# Altium schematic sheet Periphery.SchDoc
size A4; SheetNumber: 7; SheetTotal: 7
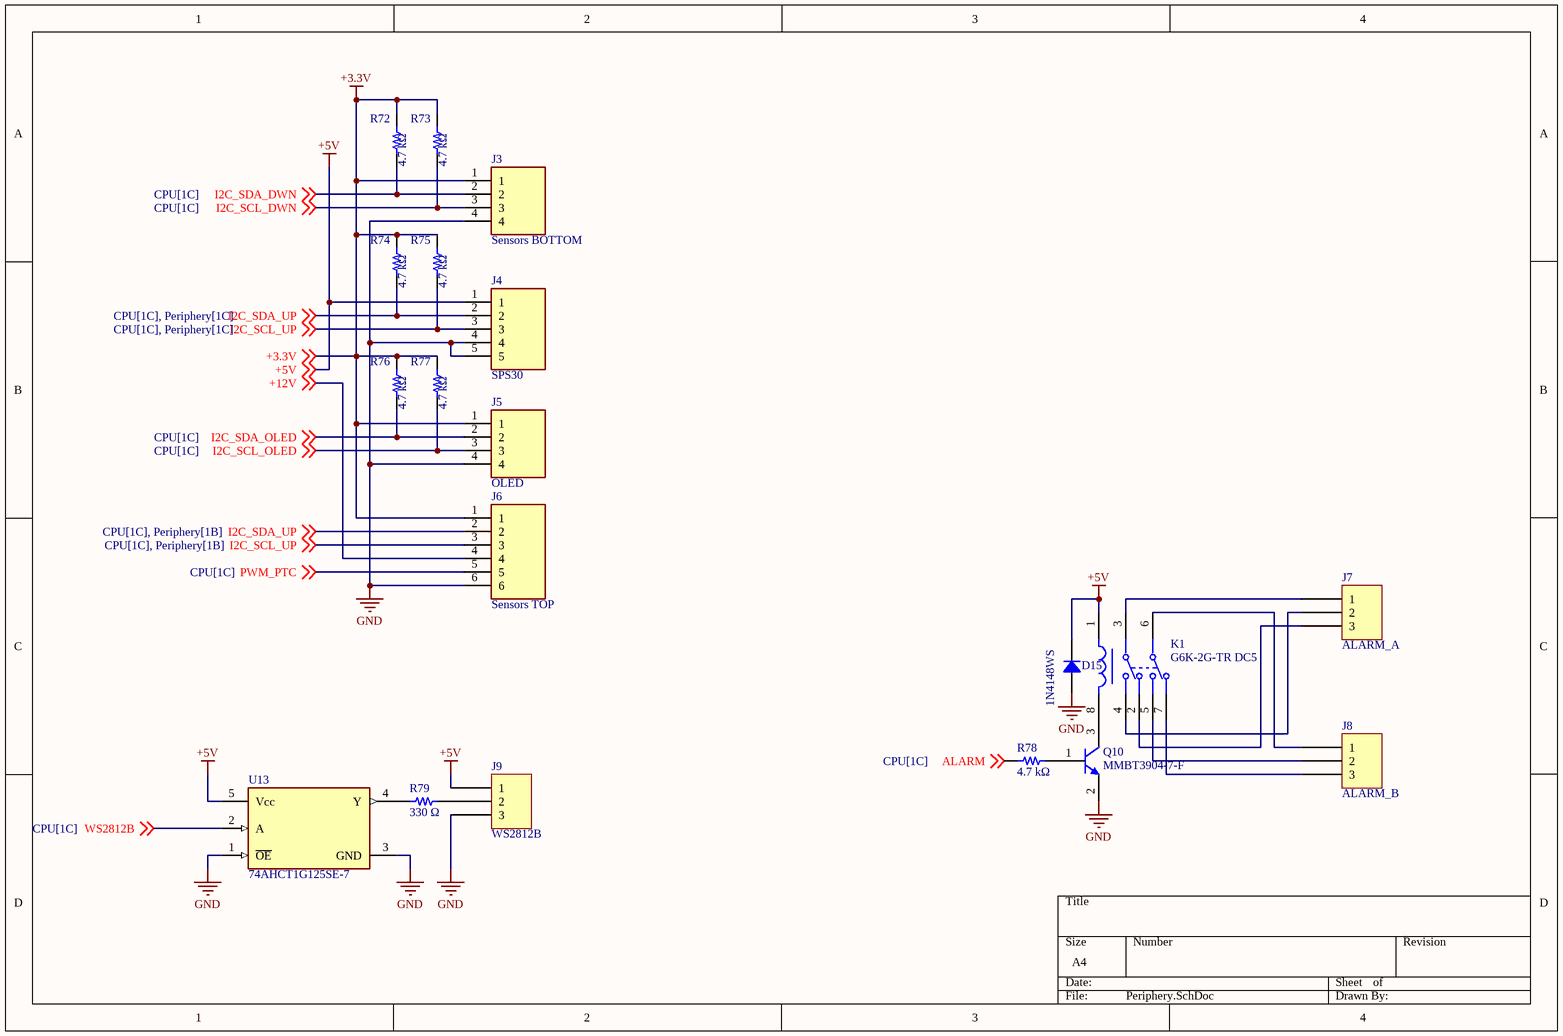
[diagram p0: Periphery.SchDoc]

## Parts
D15  1N4148WS  [SOD323F]
J3  Sensors BOTTOM  [SHDR4W50P0X150_1X4_750X350X450P]
J4  SPS30  [SHDR5W50P0X150_1X5_900X350X450P]
J5  OLED  [SHDR4W50P0X150_1X4_750X350X450P]
J6  Sensors TOP  [SHDR6W50P0X150_1X6_1050X350X450P]
J7  ALARM_A  [MOLEX KK 0022272031]
J8  ALARM_B  [MOLEX KK 0022272031]
J9  WS2812B  [MOLEX KK 0022272031]
K1  G6K-2G-TR DC5  [FP-G6K-2G-TR_DC5-MFG]
Q10  MMBT3904-7-F  [DIODES SOT-23-3]
R72  4.7 kΩ  [RES 0603_1608]
R73  4.7 kΩ  [RES 0603_1608]
R74  4.7 kΩ  [RES 0603_1608]
R75  4.7 kΩ  [RES 0603_1608]
R76  4.7 kΩ  [RES 0603_1608]
R77  4.7 kΩ  [RES 0603_1608]
R78  4.7 kΩ  [RES 0603_1608]
R79  330 Ω  [RES 0603_1608]
U13  74AHCT1G125SE-7  [FP-SOT353-IPC_A]

## Nets
+3.3V: J3.1 J5.1 J6.1 R72.2 R73.2 R74.2 R75.2 R76.2 R77.2 ; off-sheet +3.3V
+5V: D15.2 J4.1 J9.1 K1.1 U13.5(Vcc) ; off-sheet +5V
GND: D15.1 J3.4 J4.4 J4.5 J5.4 J6.6 J9.3 Q10.2(E) U13.1(~{OE}) U13.3(GND)
+12V: J6.4 ; off-sheet +12V
ALARM: R78.1 ; off-sheet ALARM
I2C_SCL_DWN: J3.3 R73.1 ; off-sheet I2C_SCL_DWN
I2C_SCL_OLED: J5.3 R77.1 ; off-sheet I2C_SCL_OLED
I2C_SCL_UP: J4.3 J6.3 R75.1 ; off-sheet I2C_SCL_UP
I2C_SDA_DWN: J3.2 R72.1 ; off-sheet I2C_SDA_DWN
I2C_SDA_OLED: J5.2 R76.1 ; off-sheet I2C_SDA_OLED
I2C_SDA_UP: J4.2 J6.2 R74.1 ; off-sheet I2C_SDA_UP
PWM_PTC: J6.5 ; off-sheet PWM_PTC
WS2812B: U13.2(A) ; off-sheet WS2812B
NetJ7_1: J7.1 K1.3
NetJ7_2: J7.2 K1.4
NetJ7_3: J7.3 K1.2
NetJ8_1: J8.1 K1.6
NetJ8_2: J8.2 K1.5
NetJ8_3: J8.3 K1.7
NetJ9_2: J9.2 R79.2
NetK1_8: K1.8 Q10.3(C)
NetQ10_1: Q10.1(B) R78.2
NetR79_1: R79.1 U13.4(Y)

## Library data of the parts
D15 = 1N4148WS: DIODE GEN PURP 75V 150MA SOD323F; Manufacturer: ON Semiconductor; Current - Reverse Leakage @ Vr: 5µA @ 75V; Diode Type: Standard; Reverse Recovery Time (trr): 4ns; Speed: Small Signal =< 200mA (Io), Any Speed; Voltage - Forward (Vf) (Max) @ If: 1V @ 10mA; Part Number: 1N4148WS; ComponentLink1Description: Datasheet; ComponentLink1URL: https://www.onsemi.com/pub/Collateral/1N914BWS-D.pdf; ComponentLink2Description: DigiKey Link; ComponentLink2URL: http://digikey.com/product-detail/en/on-semiconductor/1N4148WS/1N4148WSFSCT-ND/1873821; Current - Average Rectified (Io): 150mA; LastUpdated: 3.06.2024 19:55:04; Lifecycle Status: Active; Minimum Order: 1; Mounting Type: Surface Mount; Operating Temperature - Junction: 150°C (Max); Package / Case: SC-90, SOD-323F; Packaging: TapeAndReel; PartId: 1158; Part Status: Active; Price: 0.03; Series: -; Supplier 1: DigiKey; Supplier Part Number 1: 1N4148WSFSCT-ND; Supplier Device Package: SOD-323F; Voltage - DC Reverse (Vr) (Max): 75V
J3 J5 = B4B-ZR: JST (JAPAN SOLDERLESS TERMINALS) - B4B-ZR(LF)(SN) - HEADER, TOP ENTRY, 4WAY; Geometry.Height: 4.5mm; Manufacturer_Name: JST (JAPAN SOLDERLESS TERMINALS); Manufacturer_Part_Number: B4B-ZR(LF)(SN); Mouser Part Number: 306-B4B-ZRLFSN; Mouser Price/Stock: https://www.mouser.co.uk/ProductDetail/JST-Commercial/B4B-ZRLFSN?qs=QpmGXVUTftFM%252B0QwnoJl9g%3D%3D; Arrow Part Number: B4B-ZR(LF)(SN); Arrow Price/Stock: https://www.arrow.com/en/products/b4b-zr-lf-sn/jst-manufacturing?region=europe; Datasheet Link: https://datasheet.datasheetarchive.com/originals/distributors/Datasheets_SAMA/cb62f9f85e77727a538b6695add69f99.pdf; Supplier 1: DigiKey; Supplier Part Number 1: 455-1659-ND
J4 = B5B-ZR: CONN HEADER VERT 5POS 1.5MM; Manufacturer_Name: JST (JAPAN SOLDERLESS TERMINALS); Manufacturer_Part_Number: B5B-ZR(LF)(SN); Geometry.Height: 4.5mm; Mouser Part Number: N/A; Mouser Price/Stock: https://www.mouser.co.uk/ProductDetail/JST-Commercial/B5B-ZRLFSN?qs=IKkN%2F947nfC1UhZj5V253g%3D%3D; Arrow Part Number: B5B-ZR(LF)(SN); Arrow Price/Stock: https://www.arrow.com/en/products/b5b-zr-lf-sn/jst-manufacturing?region=europe; Datasheet Link: https://datasheet.lcsc.com/szlcsc/JST-Sales-America-B5B-ZR-LF-SN_C157990.pdf; Supplier 1: DigiKey; Supplier Part Number 1: 455-1660-ND
J6 = B6B-ZR: CONN HEADER ZH TOP 6POS 1.5MM; Manufacturer_Name: JST (JAPAN SOLDERLESS TERMINALS); Geometry.Height: 4.5mm; Manufacturer_Part_Number: B6B-ZR; Mouser Part Number: N/A; Mouser Price/Stock: https://www.mouser.co.uk/ProductDetail/JST/B6B-ZR?qs=BJlw7L4Cy7%2FnnkhPIMLEpQ%3D%3D; Arrow Part Number: *; Arrow Price/Stock: *; Datasheet Link: http://www.jst-mfg.com/product/pdf/eng/eZH.pdf; Supplier 1: DigiKey; Supplier Part Number 1: 455-B6B-ZR-ND
J7-J9 = 0022272031: CONN HEADER VERT 3POS 2.54MM; Manufacturer: Molex; Contact Length - Mating: 0.295" (7.49mm); Contact Length - Post: 0.140" (3.56mm); Material Flammability Rating: UL94 V-0; Number of Positions: 3; Number of Positions Loaded: All; Overall Contact Length: 0.560" (14.22mm); Pitch - Mating: 0.100" (2.54mm); Shrouding: Shrouded - 1 Wall; Style: Board to Cable/Wire; Part Number: 0022272031; ComponentLink1Description: Datasheet; ComponentLink1URL: https://www.molex.com/pdm_docs/sd/022272031_sd.pdf; ComponentLink2Description: DigiKey Link; ComponentLink2URL: http://digikey.com/product-detail/en/molex/0022272031/WM4112-ND/1130578; Connector Type: Header; Contact Finish - Mating: Tin; Contact Finish - Post: Tin; Contact Finish Thickness - Mating: 100.0µin (2.54µm); Contact Material: Brass; Contact Shape: Square; Contact Type: Male Pin; Fastening Type: Friction Lock; Insulation Color: Natural; Insulation Height: 0.461" (11.70mm); Insulation Material: Polyamide (PA), Nylon; LastUpdated: 12.01.2020 23:51:54; Lifecycle Status: Active; Minimum Order: 1; Mounting Type: Through Hole; Number of Rows: 1; Packaging: Bulk; PartId: 77; Part Status: Active; Price: 0.37; Series: KK 6410; Supplier 1: DigiKey; Supplier Part Number 1: WM4112-ND; Termination: Solder
K1 = CMP-08823-000110-1: RELAY TELECOM DPDT 1A 5VDC; RoHS Compliant: Yes
Q10 = MMBT3904-7-F: TRANS NPN 40V 0.2A SOT23-3; Manufacturer: Diodes Incorporated; Current - Collector Cutoff (Max): 50nA (ICBO); Current - Collector (Ic) (Max): 200 mA; DC Current Gain (hFE) (Min) @ Ic, Vce: 100 @ 10mA, 1V; Frequency - Transition: 300MHz; Power - Max: 300 mW; Vce Saturation (Max) @ Ib, Ic: 300mV @ 5mA, 50mA; Part Number: MMBT3904-7-F; ComponentLink1Description: Datasheet; ComponentLink1URL: https://www.diodes.com/assets/Datasheets/ds30036.pdf; ComponentLink2Description: DigiKey Link; ComponentLink2URL: https://www.digikey.com/en/products/detail/diodes-incorporated/MMBT3904-7-F/814494; LastUpdated: 3.06.2024 20:24:11; Lifecycle Status: Active; Minimum Order: 1; Mounting Type: Surface Mount; Operating Temperature: -55°C ~ 150°C (TJ); Package / Case: TO-236-3, SC-59, SOT-23-3; Packaging: TapeAndReel; PartId: 85; Part Status: Active; Price: 0.01; Series: -; Supplier 1: DigiKey; Supplier Part Number 1: MMBT3904-FDICT-ND; Supplier Device Package: SOT-23-3; Transistor Type: NPN; Voltage - Collector Emitter Breakdown (Max): 40 V
R72-R78 = CRCW06034K70FKEA: RES SMD 4.7K OHM 1% 1/10W 0603; Manufacturer: Vishay Dale; Power (Watts): 0.1W, 1/10W; Temperature Coefficient: ±100ppm/°C; Part Number: CRCW06034K70FKEA; Value: 4.7 kΩ; ComponentLink1Description: Datasheet; ComponentLink1URL: http://www.vishay.com/docs/20035/dcrcwe3.pdf; ComponentLink2Description: DigiKey Link; ComponentLink2URL: https://www.digikey.com/en/products/detail/vishay-dale/CRCW06034K70FKEA/1174744; Composition: Thick Film; Device Package: 0603 (1608 Metric); Features: Automotive AEC-Q200; Height - Seated (Max): 0.020" (0.50mm); LastUpdated: 9.02.2024 20:43:25; Lifecycle Status: Active; Minimum Order: 1; Number of Terminations: 2; Operating Temperature: -55°C ~ 155°C; Package / Case: 0603 (1608 Metric); Packaging: CutTape; PartId: 7812; Part Status: Active; Price: 0.01; Ratings: AEC-Q200; Resistance: 4.7 kΩ; Series: CRCW; Size / Dimension: 0.061" L x 0.033" W (1.55mm x 0.85mm); Supplier 1: DigiKey; Supplier Part Number 1: 541-4.70KHCT-ND; Supplier Device Package: 0603; Tolerance: ±1%
R79 = CRCW0603330RFKEA: RES SMD 330 OHM 1% 1/10W 0603; Manufacturer: Vishay Dale; Power (Watts): 0.1W, 1/10W; Temperature Coefficient: ±100ppm/°C; Part Number: CRCW0603330RFKEA; Value: 330 Ω; ComponentLink1Description: Datasheet; ComponentLink1URL: http://www.vishay.com/docs/20035/dcrcwe3.pdf; ComponentLink2Description: DigiKey Link; ComponentLink2URL: https://www.digikey.com/en/products/detail/vishay-dale/CRCW0603330RFKEA/1174611; Composition: Thick Film; Device Package: 0603 (1608 Metric); Features: Automotive AEC-Q200; Height - Seated (Max): 0.020" (0.50mm); LastUpdated: 9.02.2024 20:43:06; Lifecycle Status: Active; Minimum Order: 1; Number of Terminations: 2; Operating Temperature: -55°C ~ 155°C; Package / Case: 0603 (1608 Metric); Packaging: CutTape; PartId: 12596; Part Status: Active; Price: 0.01; Ratings: AEC-Q200; Resistance: 330 Ω; Series: CRCW; Size / Dimension: 0.061" L x 0.033" W (1.55mm x 0.85mm); Supplier 1: DigiKey; Supplier Part Number 1: 541-330HCT-ND; Supplier Device Package: 0603; Tolerance: ±1%
U13 = CMP-12739-000002-1: IC BUF NON-INVERT 5.5V SOT353; Logic Function: Buffer; Output Type: PUSH-PULL; Number of Bits per Element: 1; Operating Supply Voltage: 5V; Polarity: Non-Inverting; Turn-On Delay Time: 11ns; Min Supply Voltage: 4.5V; Low Level Output Current: 8mA; Quiescent Current: 1uA; High Level Output Current: -8mA; Packaging: Tape and Reel; Technology: CMOS; Number of Functions: 1; Min Operating Temperature: -40°C; Number of Pins: 5; Max Operating Temperature: 125°C; Package Quantity: 3000; Supply Voltage-Nom: 5.5V; Number of Channels: 1; Propagation Delay: 11ns; Max Supply Voltage: 5.5V; Case/Package: SOT-353; Radiation Hardening: No; Mount: Surface Mount; REACH SVHC: No SVHC; RoHS Compliant: Yes; Lead Free: Lead Free; Series: 74AHCT; Number of Outputs: 1; Number of Inputs: 1; Number of Elements: 1